# EAGLE design Macropad schem 1 (EAGLE 9.6.1)
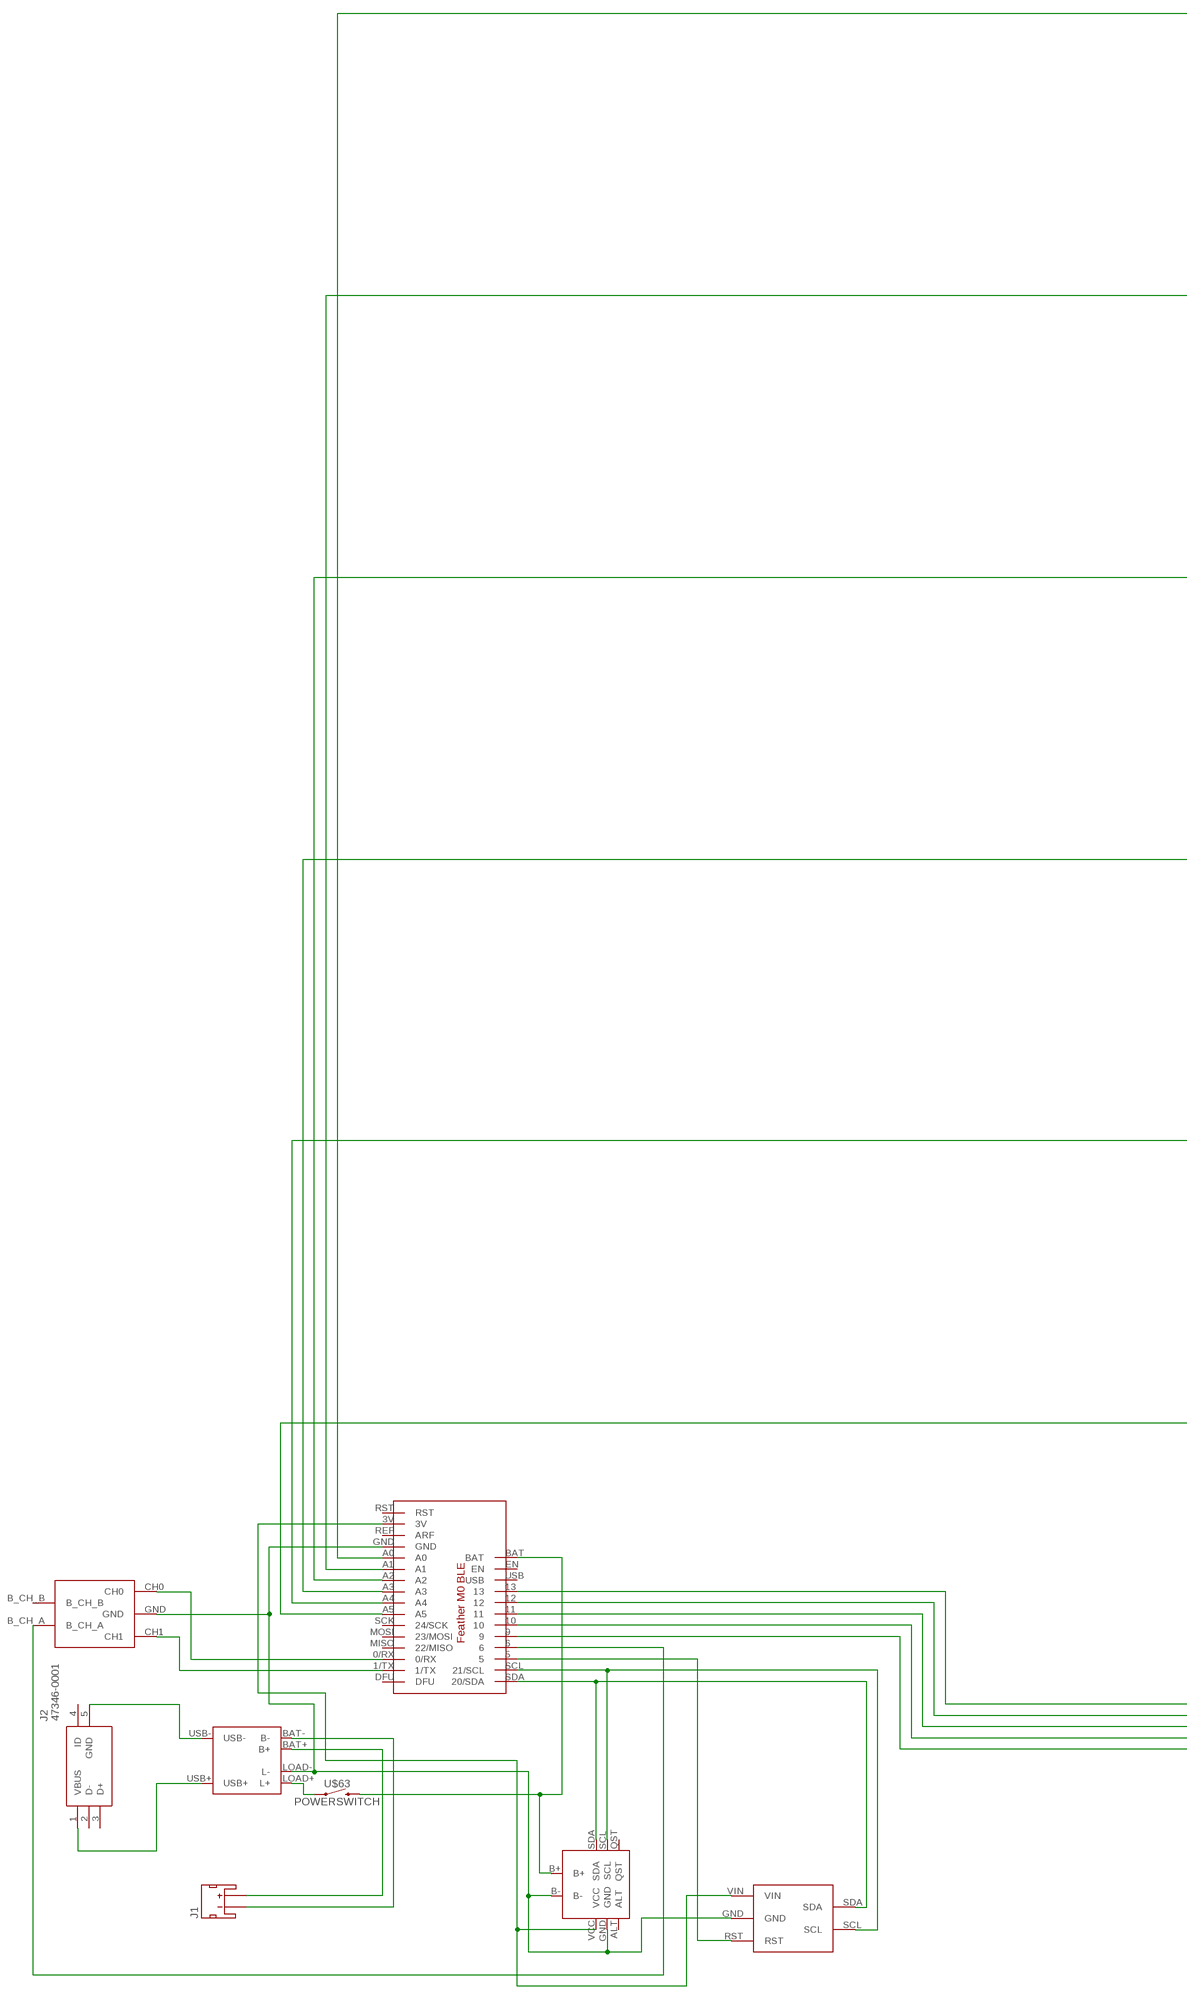
[diagram p0: schematic, sheet 1, part 1 of 2]
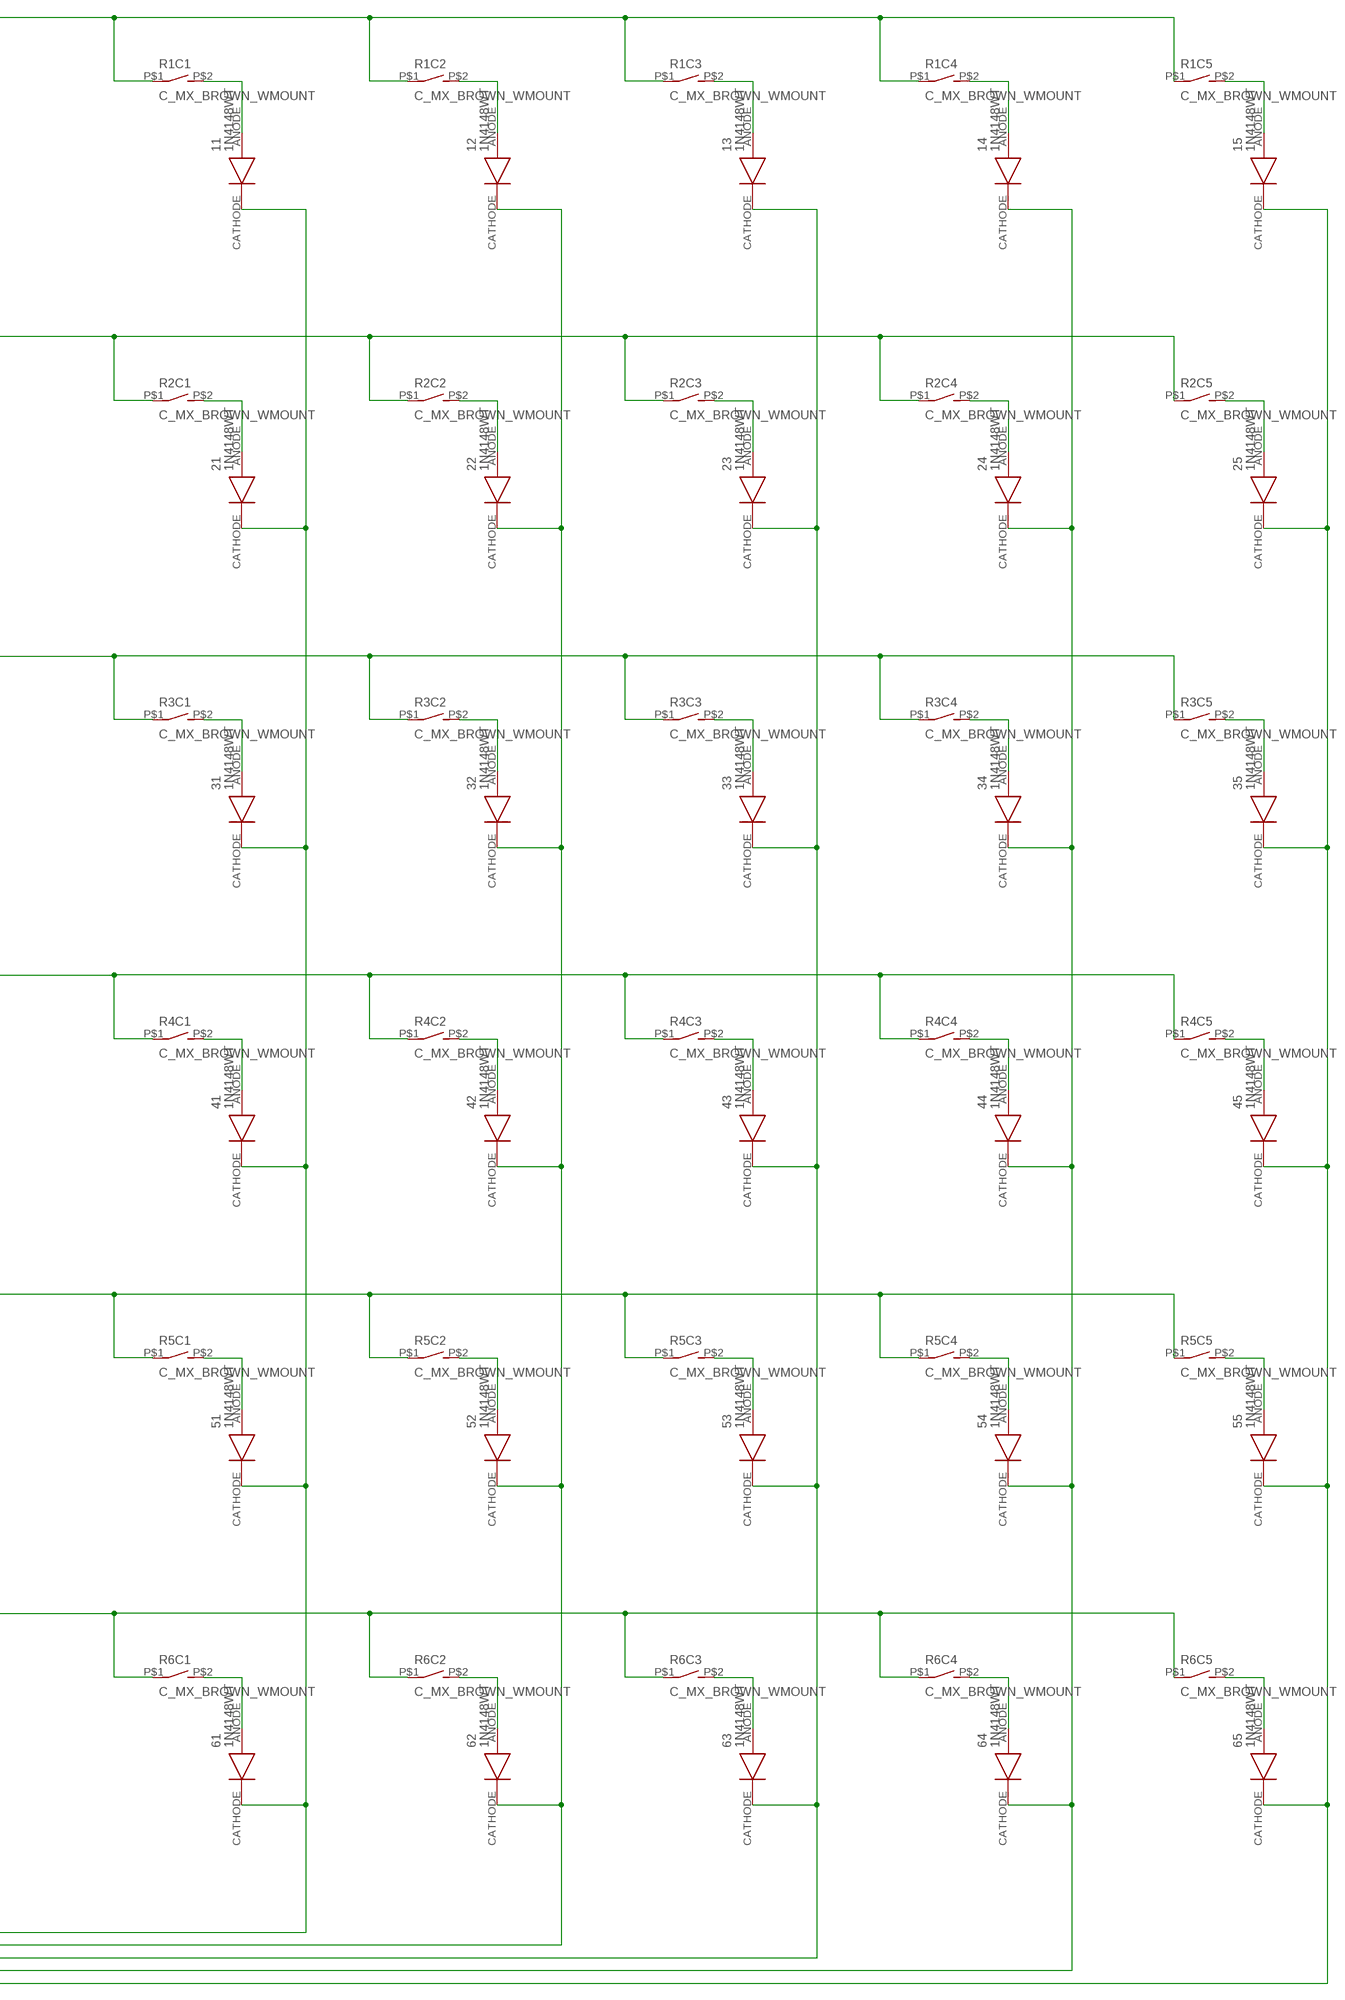
[diagram p1: schematic, sheet 1, part 2 of 2]

## Parts
11  1N4148WT  [1N4148WT]
12  1N4148WT  [1N4148WT]
13  1N4148WT  [1N4148WT]
14  1N4148WT  [1N4148WT]
15  1N4148WT  [1N4148WT]
21  1N4148WT  [1N4148WT]
22  1N4148WT  [1N4148WT]
23  1N4148WT  [1N4148WT]
24  1N4148WT  [1N4148WT]
25  1N4148WT  [1N4148WT]
31  1N4148WT  [1N4148WT]
32  1N4148WT  [1N4148WT]
33  1N4148WT  [1N4148WT]
34  1N4148WT  [1N4148WT]
35  1N4148WT  [1N4148WT]
41  1N4148WT  [1N4148WT]
42  1N4148WT  [1N4148WT]
43  1N4148WT  [1N4148WT]
44  1N4148WT  [1N4148WT]
45  1N4148WT  [1N4148WT]
51  1N4148WT  [1N4148WT]
52  1N4148WT  [1N4148WT]
53  1N4148WT  [1N4148WT]
54  1N4148WT  [1N4148WT]
55  1N4148WT  [1N4148WT]
61  1N4148WT  [1N4148WT]
62  1N4148WT  [1N4148WT]
63  1N4148WT  [1N4148WT]
64  1N4148WT  [1N4148WT]
65  1N4148WT  [1N4148WT]
J1  JST_2MM_MALE  [JST-2-SMD]
J2  47346-0001  [47346-0001]
R1C1  C_MX_BROWN_WMOUNT  [C_MX_BROWN_WMOUNT]
R1C2  C_MX_BROWN_WMOUNT  [C_MX_BROWN_WMOUNT]
R1C3  C_MX_BROWN_WMOUNT  [C_MX_BROWN_WMOUNT]
R1C4  C_MX_BROWN_WMOUNT  [C_MX_BROWN_WMOUNT]
R1C5  C_MX_BROWN_WMOUNT  [C_MX_BROWN_WMOUNT]
R2C1  C_MX_BROWN_WMOUNT  [C_MX_BROWN_WMOUNT]
R2C2  C_MX_BROWN_WMOUNT  [C_MX_BROWN_WMOUNT]
R2C3  C_MX_BROWN_WMOUNT  [C_MX_BROWN_WMOUNT]
R2C4  C_MX_BROWN_WMOUNT  [C_MX_BROWN_WMOUNT]
R2C5  C_MX_BROWN_WMOUNT  [C_MX_BROWN_WMOUNT]
R3C1  C_MX_BROWN_WMOUNT  [C_MX_BROWN_WMOUNT]
R3C2  C_MX_BROWN_WMOUNT  [C_MX_BROWN_WMOUNT]
R3C3  C_MX_BROWN_WMOUNT  [C_MX_BROWN_WMOUNT]
R3C4  C_MX_BROWN_WMOUNT  [C_MX_BROWN_WMOUNT]
R3C5  C_MX_BROWN_WMOUNT  [C_MX_BROWN_WMOUNT]
R4C1  C_MX_BROWN_WMOUNT  [C_MX_BROWN_WMOUNT]
R4C2  C_MX_BROWN_WMOUNT  [C_MX_BROWN_WMOUNT]
R4C3  C_MX_BROWN_WMOUNT  [C_MX_BROWN_WMOUNT]
R4C4  C_MX_BROWN_WMOUNT  [C_MX_BROWN_WMOUNT]
R4C5  C_MX_BROWN_WMOUNT  [C_MX_BROWN_WMOUNT]
R5C1  C_MX_BROWN_WMOUNT  [C_MX_BROWN_WMOUNT]
R5C2  C_MX_BROWN_WMOUNT  [C_MX_BROWN_WMOUNT]
R5C3  C_MX_BROWN_WMOUNT  [C_MX_BROWN_WMOUNT]
R5C4  C_MX_BROWN_WMOUNT  [C_MX_BROWN_WMOUNT]
R5C5  C_MX_BROWN_WMOUNT  [C_MX_BROWN_WMOUNT]
R6C1  C_MX_BROWN_WMOUNT  [C_MX_BROWN_WMOUNT]
R6C2  C_MX_BROWN_WMOUNT  [C_MX_BROWN_WMOUNT]
R6C3  C_MX_BROWN_WMOUNT  [C_MX_BROWN_WMOUNT]
R6C4  C_MX_BROWN_WMOUNT  [C_MX_BROWN_WMOUNT]
R6C5  C_MX_BROWN_WMOUNT  [C_MX_BROWN_WMOUNT]
U$61  ADA_FEATHER_M0_BLE  [ADA_FEATHER_M0_BLE]
U$62  ADA_LIIONCHARGER_V1.2  [ADA_LIIONCHARGER_V1.2]
U$63  POWERSWITCH  [POWERSWITCH]
U$64  LIPO_FUEL_GAUGE  [LIPO_FUEL_GAUGE]
U$65  COM-09117  [COM-09117]
U$66  I2C_OLED_DISP  [I2C_OLED_DISP]

## Nets
12: 12.CATHODE 22.CATHODE 32.CATHODE 42.CATHODE 52.CATHODE 62.CATHODE U$61.12
N$1: 11.ANODE R1C1.P$2
N$2: 12.ANODE R1C2.P$2
N$3: 13.ANODE R1C3.P$2
N$4: 14.ANODE R1C4.P$2
N$5: 15.ANODE R1C5.P$2
N$6: R1C1.P$1 R1C2.P$1 R1C3.P$1 R1C4.P$1 R1C5.P$1 U$61.A0
N$7: 21.ANODE R2C1.P$2
N$8: 22.ANODE R2C2.P$2
N$9: 23.ANODE R2C3.P$2
N$10: 24.ANODE R2C4.P$2
N$11: 25.ANODE R2C5.P$2
N$12: R2C1.P$1 R2C2.P$1 R2C3.P$1 R2C4.P$1 R2C5.P$1 U$61.A1
N$13: 31.ANODE R3C1.P$2
N$14: 32.ANODE R3C2.P$2
N$15: 33.ANODE R3C3.P$2
N$16: 34.ANODE R3C4.P$2
N$17: 35.ANODE R3C5.P$2
N$18: R3C1.P$1 R3C2.P$1 R3C3.P$1 R3C4.P$1 R3C5.P$1 U$61.A2
N$19: 41.ANODE R4C1.P$2
N$20: 42.ANODE R4C2.P$2
N$21: 43.ANODE R4C3.P$2
N$22: 44.ANODE R4C4.P$2
N$23: 45.ANODE R4C5.P$2
N$24: R4C1.P$1 R4C2.P$1 R4C3.P$1 R4C4.P$1 R4C5.P$1 U$61.A3
N$25: 51.ANODE R5C1.P$2
N$26: 52.ANODE R5C2.P$2
N$27: 53.ANODE R5C3.P$2
N$28: 54.ANODE R5C4.P$2
N$29: 55.ANODE R5C5.P$2
N$30: R5C1.P$1 R5C2.P$1 R5C3.P$1 R5C4.P$1 R5C5.P$1 U$61.A4
N$31: 61.ANODE R6C1.P$2
N$32: 62.ANODE R6C2.P$2
N$33: 63.ANODE R6C3.P$2
N$34: 64.ANODE R6C4.P$2
N$35: 65.ANODE R6C5.P$2
N$36: R6C1.P$1 R6C2.P$1 R6C3.P$1 R6C4.P$1 R6C5.P$1 U$61.A5
N$37: 11.CATHODE 21.CATHODE 31.CATHODE 41.CATHODE 51.CATHODE 61.CATHODE U$61.13
N$39: 13.CATHODE 23.CATHODE 33.CATHODE 43.CATHODE 53.CATHODE 63.CATHODE U$61.11
N$40: 14.CATHODE 24.CATHODE 34.CATHODE 44.CATHODE 54.CATHODE 64.CATHODE U$61.10
N$41: 15.CATHODE 25.CATHODE 35.CATHODE 45.CATHODE 55.CATHODE 65.CATHODE U$61.9
N$42: U$62.LOAD+(L+) U$63.1
N$43: U$61.BAT U$63.2 U$64.B+
N$44: U$61.GND U$62.LOAD-(L-) U$64.B- U$64.GND U$65.GND U$66.GND
N$45: U$61.SDA(20/SDA) U$64.SDA U$66.SDA
N$46: U$61.SCL(21/SCL) U$64.SCL U$66.SCL
N$47: J1.2(+) U$62.BAT+(B+)
N$48: U$61.3V U$64.VCC U$66.VIN
N$49: J1.1(-) U$62.BAT-(B-)
N$50: J2.5(GND) U$62.USB-
N$51: J2.1(VBUS) U$62.USB+
N$52: U$61.1/TX U$65.CH1
N$53: U$61.0/RX U$65.CH0
N$54: U$61.6 U$65.B_CH_A
N$57: U$61.5 U$66.RST
Unconnected: J1.NC1(PAD1) J1.NC2(PAD2) J2.2(D-) J2.3(D+) J2.4(ID) U$61.DFU U$61.EN U$61.MISO(22/MISO) U$61.MOSI(23/MOSI) U$61.REF(ARF) U$61.RST U$61.SCK(24/SCK) U$61.USB U$64.ALT U$64.QST U$65.B_CH_B

## Library data of the parts
11-15 21-25 31-35 41-45 51-55 61-65 = Macro-Pad:1N4148WT
J1 = SparkFun-Connectors:JST_2MM_MALE: JST 2MM MALE RA CONNECTOR Two pin, compact surface mount connector. Commonly used as a battery input connection point. We really like the solid locking feeling and high current rating on these small connectors. We use these all the time as battery connectors. Mates to single-cell LiPo batteries. Here is the connector we sell at SparkFun: JST Right Angle Connector - White <https://www.sparkfun.com/products/8612> (PRT-08612) Datasheet <http://www.sparkfun.com/datasheets/Prototyping/Connectors/JST-Horizontal.pdf> It was used on these SparkFun products: SparkFun MOSFET Power Controller <https://www.sparkfun.com/products/11214> (PRT-11214) SparkFun Battery Babysitter - LiPo Battery Manager <https://www.sparkfun.com/products/13777> (PRT-13777) And many, many others that required a lipo battery connection.; PROD_ID: CONN-11443; SF_ID: PRT-08612
J2 = SamacSys_Parts:47346-0001: Micro USB B Receptacle Bottom Mount Assy Molex Right Angle SMT Type B Version 2.0 Micro USB Connector Socket, 30 V ac, 1A 47352 MICRO-USB Source: Datasheet <http://www.molex.com/pdm_docs/sd/473460001_sd.pdf>; DESCRIPTION: Micro USB B Receptacle Bottom Mount Assy Molex Right Angle SMT Type B Version 2.0 Micro USB Connector Socket, 30 V ac, 1A 47352 MICRO-USB; HEIGHT: mm; MANUFACTURER_NAME: Molex; MANUFACTURER_PART_NUMBER: 47346-0001; MOUSER_PART_NUMBER: 538-47346-0001; MOUSER_PRICE-STOCK: https://www.mouser.co.uk/ProductDetail/Molex/47346-0001?qs=c2CV6XM0DweJBWaSeyWeCw%3D%3D
R1C1-R1C5 R2C1-R2C5 R3C1-R3C5 R4C1-R4C5 R5C1-R5C5 R6C1-R6C5 = Macro-Pad:C_MX_BROWN_WMOUNT
U$61 = Macro-Pad:ADA_FEATHER_M0_BLE
U$62 = Macro-Pad:ADA_LIIONCHARGER_V1.2
U$63 = Macro-Pad:POWERSWITCH
U$64 = Macro-Pad:LIPO_FUEL_GAUGE
U$65 = Macro-Pad:COM-09117
U$66 = Macro-Pad:I2C_OLED_DISP

## Board
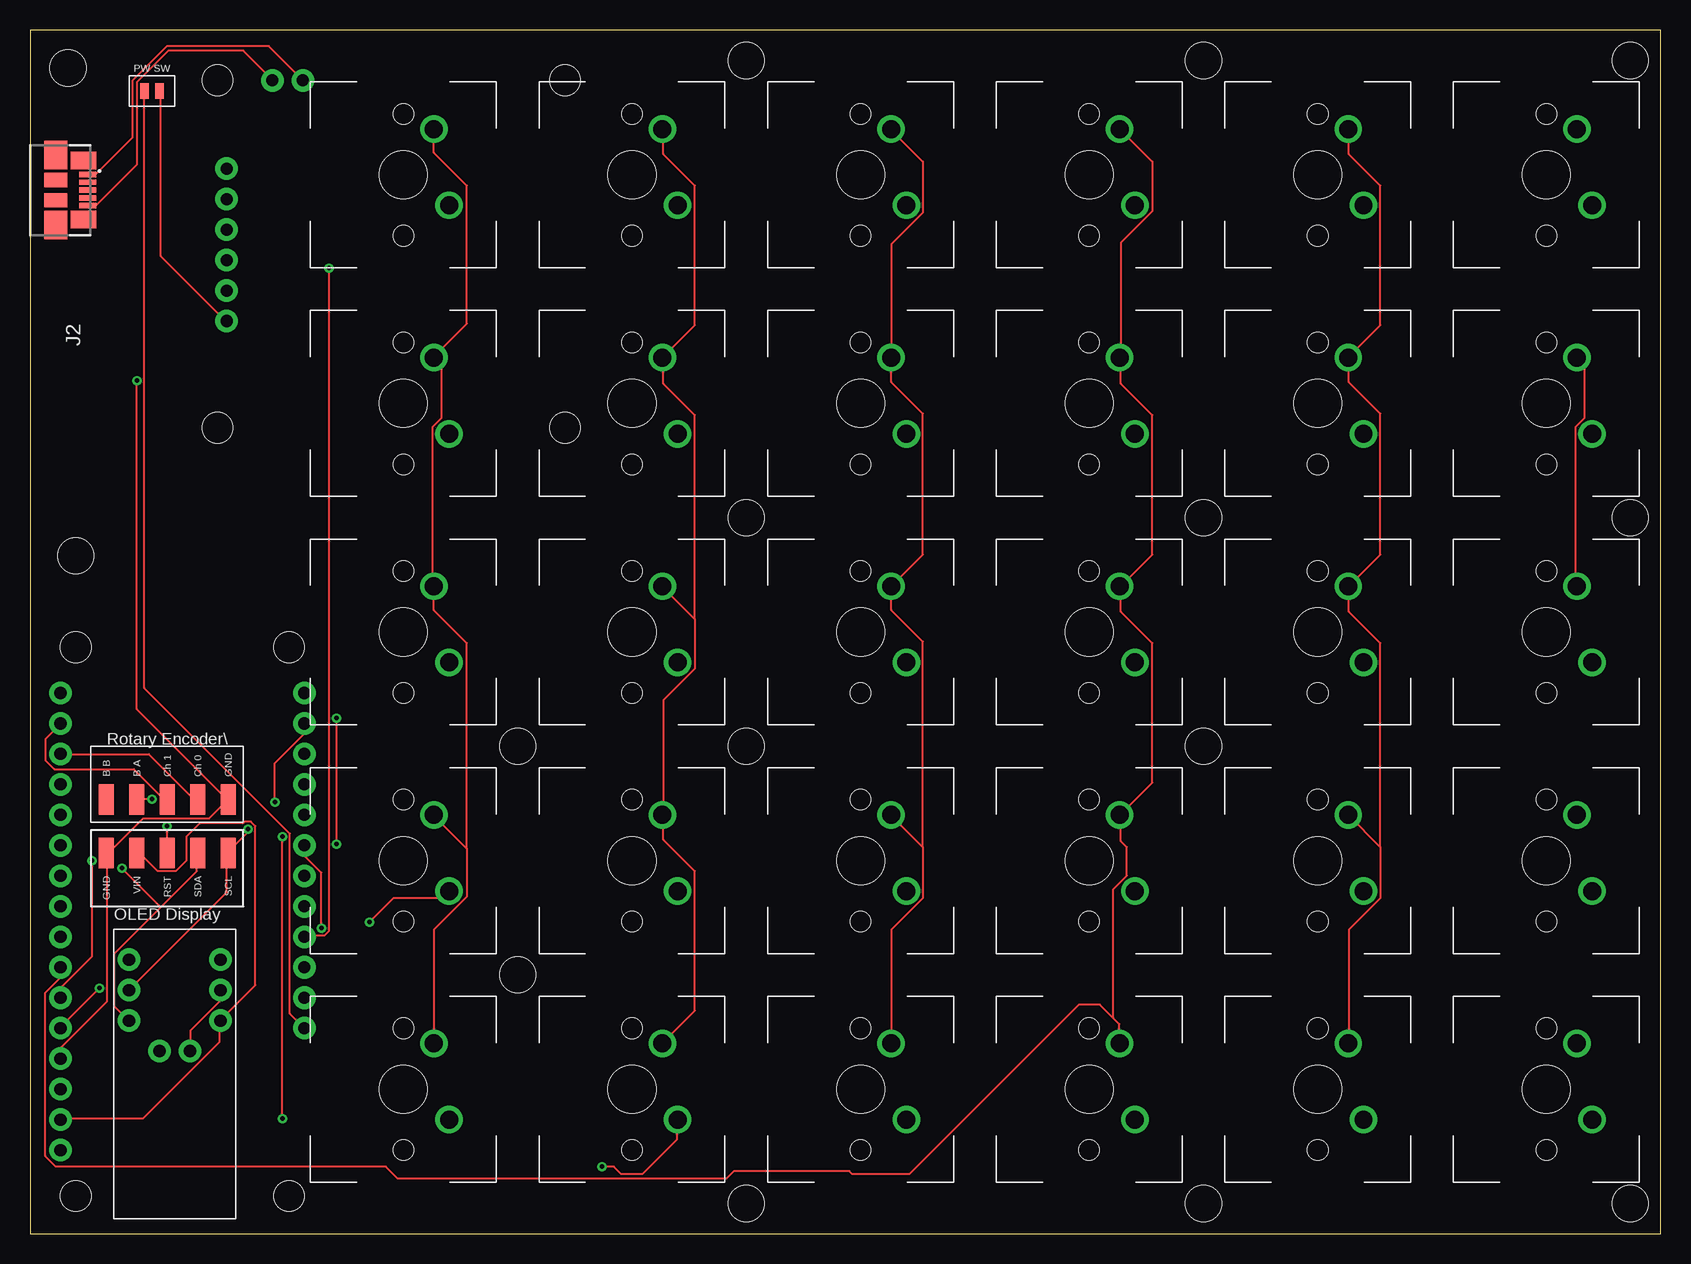
[diagram p2: board, top side]
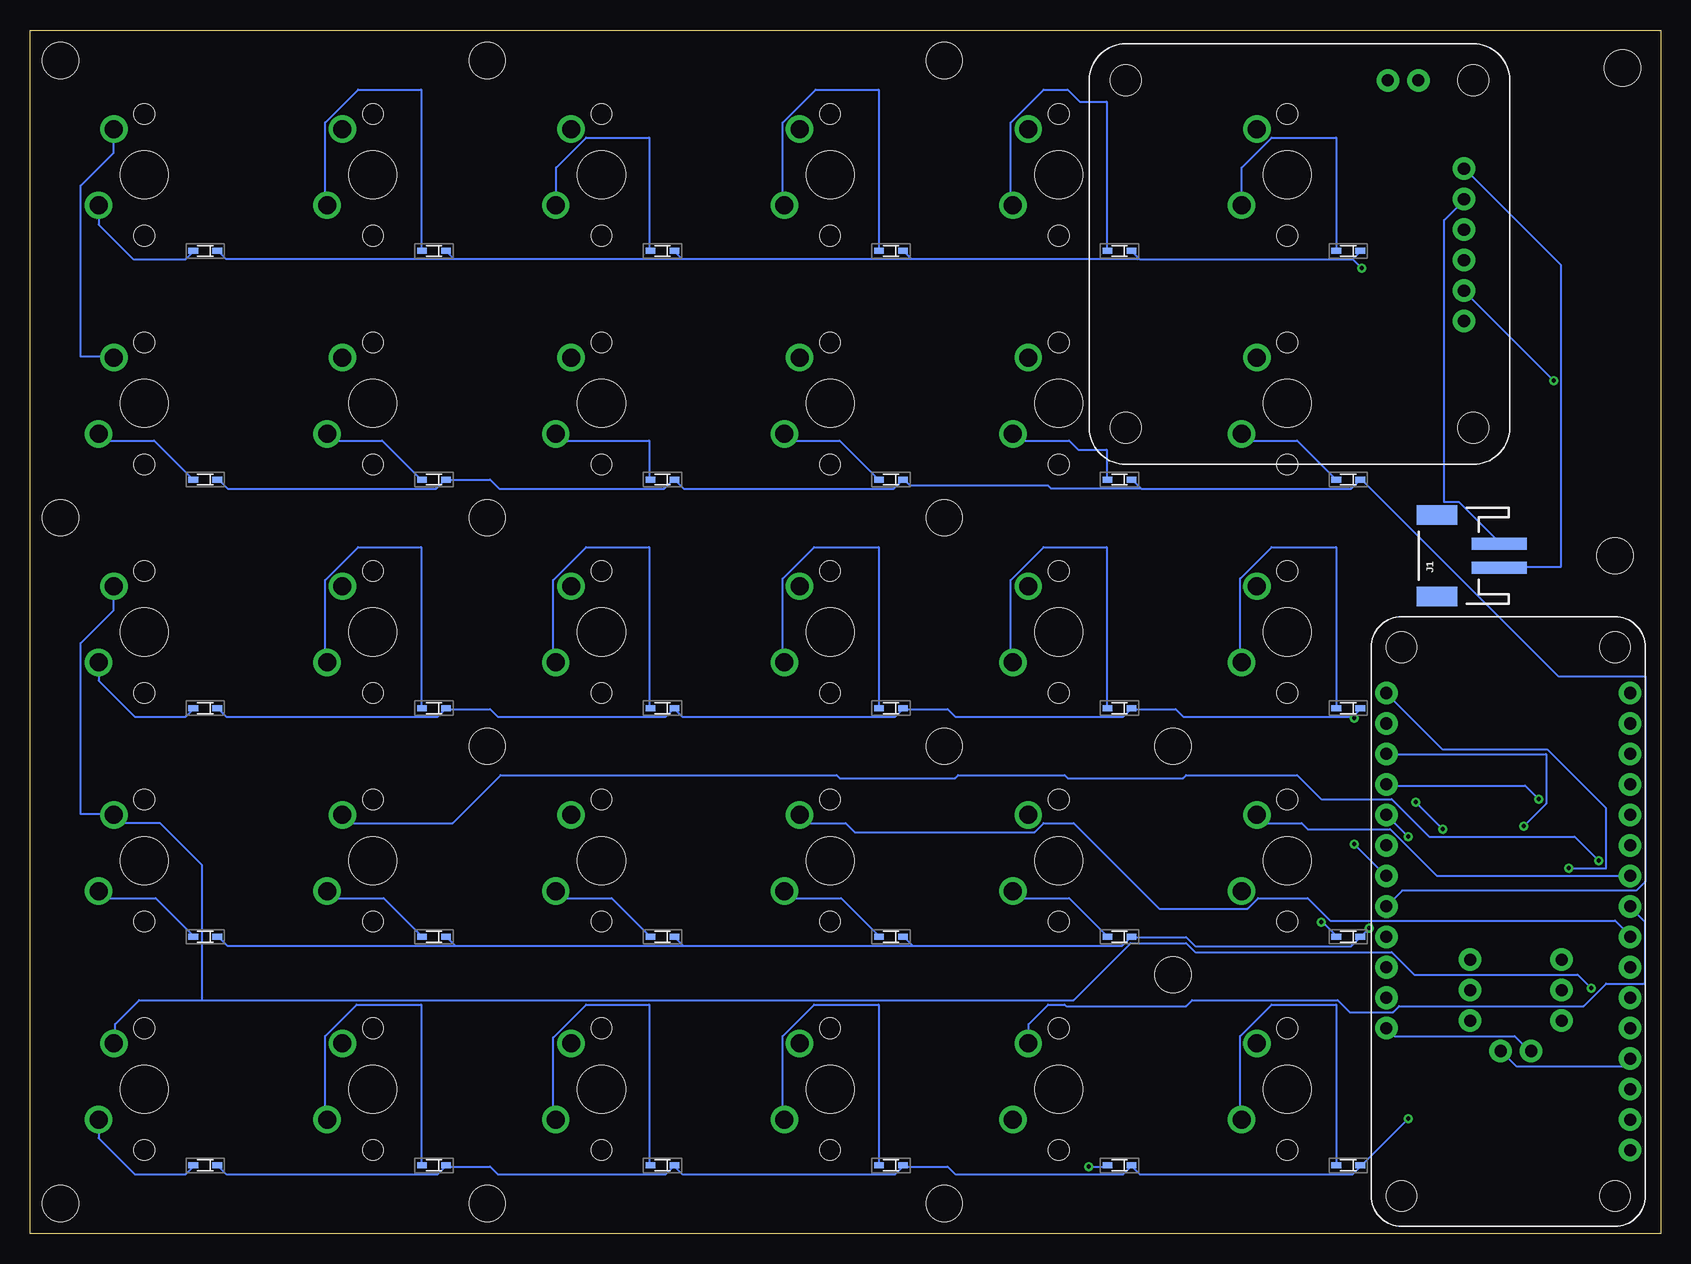
[diagram p3: board, bottom side, seen from below]

Size 135.89 x 100.33 mm. Coordinates in mm from the lower left corner, seen from the top.
Outline: 0,0 135.89,0 135.89,100.33 0,100.33 0,0
Copper layers (1*16): Top 0.035mm / dielectric 1.5mm / Bottom 0.035mm
Design rules "default": minimum track width 6mil, minimum drill 0.35mm, track to track 6mil, track to pad 6mil, pad to pad 6mil, via to via 6mil, smd to smd 6mil, copper to edge 40mil, drill to drill 6mil, minimum pad ring 10mil, minimum via ring 8mil, stop-mask expansion 4mil, vias tented up to drill 0mil, thermal gap 10mil
Holes 3 mm at 133.35,97.79 133.35,2.54 3.81,56.52 3.17,97.16 133.35,59.69 97.79,2.54 97.79,97.79 97.79,59.69 97.79,40.64 59.69,2.54 59.69,97.79 59.69,59.69 59.69,40.64 40.64,21.59 40.64,40.64

### Footprints (pad centres in the part's own frame; a part is rotated, then mirrored left to right if it is on the bottom)
1N4148WT = smd 0.8 x 0.5: ANODE 1,0; CATHODE -1,0
JST-2-SMD = smd 1 x 4.6: 1 -1,-3.7; 2 1,-3.7 | smd 1.6 x 3.4: NC1 -3.4,1.5; NC2 3.4,1.5
47346-0001 = smd 0.45 x 1.38: 1 1.3,-4.81; 2 0.65,-4.81; 3 0,-4.81; 4 -0.65,-4.81; 5 -1.3,-4.81 | smd 1.475 x 2.1: 6 -2.453,-4.45; 7 2.453,-4.45 | smd 1.175 x 1.9: 8 0.838,-2.15; 9 -0.838,-2.15 | smd 2.375 x 1.9: 10 2.913,-2.15; 11 -2.913,-2.15
C_MX_BROWN_WMOUNT = drill 1.499 pad 2.286: P$1 -3.81,2.54; P$2 2.54,3.81 | hole 3.988: 0,0 | hole 1.702: -5.08,0; 5.08,0
ADA_FEATHER_M0_BLE = drill 1.016 pad 1.88: 0/RX 13.97,-10.16; 1/TX 16.51,-10.16; 3V -16.51,-10.16; 5 13.97,10.16; 6 11.43,10.16; 9 8.89,10.16; 10 6.35,10.16; 11 3.81,10.16; 12 1.27,10.16; 13 -1.27,10.16; A0 -8.89,-10.16; A1 -6.35,-10.16; A2 -3.81,-10.16; A3 -1.27,-10.16; A4 1.27,-10.16; A5 3.81,-10.16; BAT -8.89,10.16; DFU 19.05,-10.16; EN -6.35,10.16; GND -11.43,-10.16; MISO 11.43,-10.16; MOSI 8.89,-10.16; REF -13.97,-10.16; RST -19.05,-10.16; SCK 6.35,-10.16; SCL 16.51,10.16; SDA 19.05,10.16; USB -3.81,10.16 | hole 2.54: 22.86,-8.89; 22.86,8.89; -22.86,-8.89; -22.86,8.89
ADA_LIIONCHARGER_V1.2 = drill 1.016 pad 1.88: BAT+ 31.242,22.098; BAT- 31.242,24.638; LOAD+ 31.242,11.938; LOAD- 31.242,14.478; STAT1 31.242,19.558; STAT2 31.242,17.018; USB+ 24.892,32.004; USB- 27.432,32.004 | hole 2.54: 3.048,3.048; 3.048,32.004; 32.004,32.004; 32.004,3.048
POWERSWITCH = smd 0.711 x 1.295: 1 -1.27,0; 2 0,0
LIPO_FUEL_GAUGE = drill 1.016 pad 1.88: ALT 0,0; B+ -7.62,5.08; B- -7.62,2.54; GND -2.54,0; QST 0,7.62; SCL -2.54,7.62; SDA -5.08,7.62; VCC -5.08,0
COM-09117 = smd 1.27 x 2.54: B_CH_A 6.35,0; B_CH_B 8.89,0; CH0 1.27,0; CH1 3.81,0; GND -1.27,0
I2C_OLED_DISP = smd 1.27 x 2.54: GND -5.08,0; RST 0,0; SCL 5.08,0; SDA 2.54,0; VIN -2.54,0

### Placement (x,y rotation side)
11  121.28,81.91 180 bottom
12  121.28,62.87 180 bottom
13  121.28,43.82 180 bottom
14  121.28,24.76 180 bottom
15  121.28,5.71 180 bottom
21  102.23,81.91 180 bottom
22  102.23,62.87 180 bottom
23  102.23,43.82 180 bottom
24  102.23,24.76 180 bottom
25  102.23,5.71 180 bottom
31  83.19,81.91 180 bottom
32  83.19,62.87 180 bottom
33  83.19,43.82 180 bottom
34  83.19,24.76 180 bottom
35  83.19,5.71 180 bottom
41  64.13,81.91 180 bottom
42  64.13,62.87 180 bottom
43  64.13,43.82 180 bottom
44  64.13,24.76 180 bottom
45  64.13,5.71 180 bottom
51  45.09,81.91 180 bottom
52  45.09,62.87 180 bottom
53  45.09,43.82 180 bottom
54  45.09,24.76 180 bottom
55  45.09,5.71 180 bottom
61  26.04,81.91 180 bottom
62  26.04,62.87 180 bottom
63  26.04,43.82 180 bottom
64  26.04,24.76 180 bottom
65  26.04,5.71 180 bottom
J1  17.14,56.52 90 bottom
J2  0,86.99 90 top
R1C1  126.37,88.27 270 top
R1C2  126.37,69.21 270 top
R1C3  126.37,50.16 270 top
R1C4  126.37,31.11 270 top
R1C5  126.37,12.06 270 top
R2C1  107.31,88.27 270 top
R2C2  107.31,69.21 270 top
R2C3  107.31,50.16 270 top
R2C4  107.31,31.11 270 top
R2C5  107.31,12.06 270 top
R3C1  88.26,88.27 270 top
R3C2  88.26,69.21 270 top
R3C3  88.26,50.16 270 top
R3C4  88.26,31.11 270 top
R3C5  88.26,12.06 270 top
R4C1  69.22,88.27 270 top
R4C2  69.22,69.21 270 top
R4C3  69.22,50.16 270 top
R4C4  69.22,31.11 270 top
R4C5  69.22,12.06 270 top
R5C1  50.16,88.27 270 top
R5C2  50.16,69.21 270 top
R5C3  50.16,50.16 270 top
R5C4  50.16,31.11 270 top
R5C5  50.16,12.06 270 top
R6C1  31.11,88.27 270 top
R6C2  31.11,69.21 270 top
R6C3  31.11,50.16 270 top
R6C4  31.11,31.11 270 top
R6C5  31.11,12.06 270 top
U$61  12.7,26.04 90 bottom
U$62  47.62,64.13 0 bottom
U$63  9.52,95.25 180 top
U$64  15.88,22.86 90 top
U$65  15.24,36.2 180 top
U$66  11.43,31.75 0 top

### Tracks (layer width: path | path; a pad name or v marks a point on that pad's centre or on a via)
12
  Bottom 0.152: 12.CATHODE 120.16,62.87 119.41,62.12 102.04,62.12 101.29,62.87 22.CATHODE 97.54,62.87 96.79,62.12 83.04,62.12 82.29,62.87 32.CATHODE 82.16,62.87 81.41,62.12 63.91,62.12 63.16,62.87 42.CATHODE 63.04,62.87 62.54,62.37 51.04,62.37 50.79,62.12 43.29,62.12 | 43.29,62.12 25.79,62.12 62.CATHODE 24.91,62.87 8.54,46.49 1.29,46.49 1.29,29.36 2.04,28.61 21.54,28.61 22.79,27.36 U$61.12 | 43.29,62.12 44.04,62.87 52.CATHODE
N$1
  Bottom 0.152: 11.ANODE 122.29,81.86 122.91,81.24 127.29,81.24 130.16,84.11 130.16,85.61 R1C1.P$2
N$2
  Bottom 0.152: 12.ANODE 125.54,66.11 129.66,66.11 130.16,66.61 R1C2.P$2
N$3
  Bottom 0.152: 13.ANODE 122.29,43.74 122.91,43.12 127.16,43.12 130.16,46.12 R1C3.P$2
N$4
  Bottom 0.152: 14.ANODE 122.29,24.86 125.41,27.99 129.66,27.99 130.16,28.49 R1C4.P$2
N$5
  Bottom 0.152: 15.ANODE 122.29,5.62 122.91,4.99 127.16,4.99 130.16,7.99 130.16,9.49 R1C5.P$2
N$6  (via drill 0.35)
  Top 0.152: R1C3.P$1 128.79,53.99 128.79,67.24 129.54,67.99 129.54,72.36 128.91,72.99 R1C2.P$1 | v5.79,20.49 2.54,17.24 U$61.A0
  Bottom 0.152: R1C1.P$1 128.91,91.99 128.91,90.11 131.66,87.36 131.66,73.11 128.91,73.11 R1C2.P$1 | v5.79,20.49 6.91,21.61 20.54,21.61 22.41,23.49 38.79,23.49 39.54,24.24 44.16,24.24 48.91,19.49 121.54,19.49 | 121.54,19.49 126.79,19.49 128.79,17.49 128.79,15.99 R1C5.P$1 | 121.54,19.49 121.54,30.74 125.04,34.24 128.16,34.24 128.79,34.87 R1C4.P$1 128.91,34.99 131.66,34.99 131.66,49.24 128.91,51.99 128.91,53.87 R1C3.P$1
N$7
  Bottom 0.152: 21.ANODE 103.29,81.99 103.29,95.36 108.54,95.36 111.29,92.61 111.29,85.74 111.16,85.74 R2C1.P$2
N$8
  Bottom 0.152: 22.ANODE 103.29,62.87 106.54,66.11 110.54,66.11 111.04,66.61 R2C2.P$2
N$9
  Bottom 0.152: 23.ANODE 103.29,43.87 103.29,57.24 108.54,57.24 111.29,54.49 111.29,47.74 111.16,47.74 R2C3.P$2
N$10
  Bottom 0.152: R2C4.P$2 110.54,27.99 106.41,27.99 103.29,24.86 24.ANODE
N$11
  Bottom 0.152: 25.ANODE 103.29,5.74 103.29,19.11 108.66,19.11 111.29,16.49 111.29,9.62 111.16,9.62 R2C5.P$2
N$12  (via drill 0.35)
  Top 0.152: U$61.A1 2.54,20.49 5.16,23.11 v5.16,31.11 | 112.54,32.24 112.54,27.99 109.91,25.36 109.91,15.99 R2C5.P$1 | R2C4.P$1 112.54,32.24 | 112.54,32.24 112.54,49.24 109.91,51.87 109.91,53.87 R2C3.P$1 109.91,53.99 112.54,56.62 112.54,68.36 109.91,70.99 109.91,72.99 R2C2.P$1 109.91,73.11 112.54,75.74 112.54,87.36 109.91,89.99 109.91,91.99 R2C1.P$1
  Bottom 0.152: v5.16,31.11 7.16,33.12 19.29,33.12 22.41,36.24 28.29,36.24 30.29,38.24 39.54,38.24 39.79,37.99 49.41,37.99 49.66,38.24 58.54,38.24 58.79,37.99 68.41,37.99 68.66,38.24 96.66,38.24 100.66,34.24 109.16,34.24 109.79,34.87 R2C4.P$1
N$13
  Bottom 0.152: 31.ANODE 84.29,81.99 84.29,91.36 89.54,91.36 92.04,88.86 92.04,85.74 R3C1.P$2
N$14
  Bottom 0.152: 32.ANODE 84.29,62.87 84.29,66.11 91.54,66.11 92.04,66.61 R3C2.P$2
N$15
  Bottom 0.152: 33.ANODE 84.29,43.87 84.29,57.24 89.54,57.24 92.29,54.49 92.29,47.74 92.16,47.74 R3C3.P$2
N$16
  Bottom 0.152: 34.ANODE 84.29,24.86 87.41,27.99 91.54,27.99 92.04,28.49 R3C4.P$2
N$17
  Bottom 0.152: 35.ANODE 84.29,5.74 84.29,19.11 89.54,19.11 92.29,16.36 92.29,9.62 92.16,9.62 R3C5.P$2
N$18
  Top 0.152: R3C1.P$1 90.91,91.99 93.54,89.36 93.54,85.24 90.91,82.61 90.91,73.11 R3C2.P$1 90.91,72.99 90.91,70.86 93.54,68.24 93.54,56.62 90.91,53.99 R3C3.P$1 90.91,53.87 90.91,51.87 93.54,49.24 93.54,37.62 90.91,34.99 R3C4.P$1 90.91,34.87 90.91,32.74 91.41,32.24 91.41,29.86 90.29,28.74 90.29,17.99 | U$61.A2 2.54,21.36 1.29,20.11 1.29,6.49 2.16,5.62 29.66,5.62 30.66,4.62 58.04,4.62 58.66,5.24 68.29,5.24 68.54,4.99 73.29,4.99 87.41,19.11 89.16,19.11 90.29,17.99 | 90.29,17.99 90.79,17.49 90.79,15.99 R3C5.P$1
N$19
  Bottom 0.152: 41.ANODE 65.16,81.99 65.16,95.36 70.41,95.36 73.16,92.61 73.16,85.74 73.04,85.74 R4C1.P$2
N$20
  Bottom 0.152: 42.ANODE 65.16,62.87 68.41,66.11 72.41,66.11 72.91,66.61 R4C2.P$2
N$21
  Bottom 0.152: 43.ANODE 65.16,43.87 65.16,57.24 70.54,57.24 73.16,54.62 73.16,47.74 73.04,47.74 R4C3.P$2
N$22
  Bottom 0.152: 44.ANODE 65.16,24.86 68.29,27.99 72.41,27.99 72.91,28.49 R4C4.P$2
N$23
  Bottom 0.152: 45.ANODE 65.16,5.74 65.16,19.11 70.54,19.11 73.16,16.49 73.16,9.62 73.04,9.62 R4C5.P$2
N$24
  Top 0.152: R4C1.P$1 71.79,91.99 74.41,89.36 74.41,85.11 71.79,82.49 71.79,73.11 R4C2.P$1 71.79,72.99 71.79,70.99 74.41,68.36 74.41,56.62 71.79,53.99 R4C3.P$1 71.79,53.87 71.79,51.99 74.41,49.37 74.41,32.24 | 74.41,32.24 74.41,27.99 71.79,25.36 71.79,15.99 R4C5.P$1 | 74.41,32.24 71.79,34.87 R4C4.P$1
  Bottom 0.152: U$61.A3 2.54,24.86 3.79,26.11 27.54,26.11 29.41,27.99 33.54,27.99 34.41,27.11 41.79,27.11 48.91,34.24 51.41,34.24 52.16,33.49 67.16,33.49 67.91,34.24 71.04,34.24 71.66,34.87 R4C4.P$1
N$25
  Bottom 0.152: 51.ANODE 46.16,81.99 46.16,94.36 48.41,94.36 49.41,95.36 51.41,95.36 54.16,92.61 54.16,85.74 54.04,85.74 R5C1.P$2
N$26
  Bottom 0.152: R5C2.P$2 53.41,66.11 49.29,66.11 48.54,65.36 46.16,65.36 46.16,62.87 52.ANODE
N$27
  Bottom 0.152: 53.ANODE 46.16,43.87 46.16,57.24 51.41,57.24 54.16,54.49 54.16,47.74 54.04,47.74 R5C3.P$2
N$28
  Bottom 0.152: 54.ANODE 46.16,24.86 49.29,27.99 53.41,27.99 53.91,28.49 R5C4.P$2
N$29  (via drill 0.35)
  Top 0.152: v47.66,5.62 48.66,5.62 49.29,4.99 51.04,4.99 53.91,7.87 53.91,9.49 R5C5.P$2
  Bottom 0.152: v47.66,5.62 46.16,5.62 55.ANODE
N$30
  Top 0.152: 55.41,51.24 55.41,47.12 52.79,44.49 52.79,34.99 R5C4.P$1 52.79,34.87 52.79,32.87 55.41,30.24 55.41,18.61 52.79,15.99 R5C5.P$1 | 55.41,51.24 52.79,53.87 R5C3.P$1 | 55.41,51.24 55.41,68.24 52.79,70.86 52.79,72.99 R5C2.P$1 52.79,73.11 55.41,75.74 55.41,87.36 52.79,89.99 52.79,91.99 R5C1.P$1
  Bottom 0.152: U$61.A4 2.54,27.24 1.29,25.99 1.29,20.86 4.54,20.86 6.41,18.99 21.79,18.99 22.29,18.49 25.91,18.49 26.91,19.49 39.04,19.49 39.54,18.99 49.54,18.99 49.66,19.11 51.04,19.11 52.66,17.49 52.66,15.99 R5C5.P$1
N$31
  Bottom 0.152: 61.ANODE 27.04,81.99 27.04,91.36 32.41,91.36 34.91,88.86 34.91,85.74 R6C1.P$2
N$32
  Bottom 0.152: 62.ANODE 30.29,66.11 34.41,66.11 34.91,66.61 R6C2.P$2
N$33
  Bottom 0.152: 63.ANODE 27.04,43.87 27.04,57.24 32.41,57.24 35.04,54.62 35.04,47.74 R6C3.P$2
N$34  (via drill 0.35)
  Top 0.152: v28.29,25.99 30.29,27.99 34.41,27.99 34.91,28.49 R6C4.P$2
  Bottom 0.152: v28.29,25.99 28.16,25.99 27.04,24.86 64.ANODE
N$35
  Bottom 0.152: 65.ANODE 27.04,5.74 27.04,19.11 32.41,19.11 35.04,16.49 35.04,9.62 R6C5.P$2
N$36
  Top 0.152: R6C1.P$1 33.66,91.99 33.66,90.11 36.41,87.36 36.41,75.86 33.66,73.11 R6C2.P$1 33.66,72.99 34.29,72.36 34.29,67.99 33.54,67.24 33.54,53.99 R6C3.P$1 33.66,53.87 33.66,51.99 36.41,49.24 36.41,32.12 | 36.41,32.12 36.41,28.11 33.66,25.36 33.66,15.99 R6C5.P$1 | 36.41,32.12 33.66,34.87 R6C4.P$1
  Bottom 0.152: U$61.A5 2.54,29.86 18.66,29.86 22.54,33.74 29.41,33.74 29.91,34.24 32.91,34.24 33.54,34.87 R6C4.P$1
N$37  (via drill 0.35)
  Top 0.152: v24.91,80.49 24.91,25.24 24.54,24.86 22.91,24.86 U$61.13
  Bottom 0.152: 25.66,81.24 25.04,81.86 61.CATHODE | 43.41,81.24 25.66,81.24 | 43.41,81.24 44.04,81.86 51.CATHODE | 62.41,81.24 63.04,81.86 41.CATHODE | 43.41,81.24 62.41,81.24 | 81.54,81.24 82.16,81.86 31.CATHODE | 62.41,81.24 81.54,81.24 | 100.54,81.24 101.16,81.86 21.CATHODE | 81.54,81.24 100.54,81.24 | 100.54,81.24 119.54,81.24 120.16,81.86 11.CATHODE | 25.66,81.24 v24.91,80.49
N$39  (via drill 0.35)
  Top 0.152: v25.54,42.99 v25.54,32.49
  Bottom 0.152: 25.66,43.12 25.04,43.74 63.CATHODE | 25.66,43.12 39.79,43.12 40.41,43.74 44.04,43.74 53.CATHODE 44.16,43.74 44.79,43.12 58.79,43.12 59.41,43.74 63.04,43.74 43.CATHODE 63.16,43.74 63.79,43.12 81.54,43.12 82.16,43.74 33.CATHODE 82.29,43.74 82.91,43.12 96.91,43.12 97.54,43.74 101.16,43.74 23.CATHODE 101.29,43.74 101.91,43.12 119.54,43.12 120.16,43.74 13.CATHODE | v25.54,32.49 22.91,29.86 U$61.11 | 25.66,43.12 v25.54,42.99
N$40  (via drill 0.35)
  Top 0.152: v24.29,25.49 24.29,30.11 22.91,31.49 22.91,32.37 U$61.10
  Bottom 0.152: 62.29,23.99 63.04,24.74 44.CATHODE | 62.29,23.99 44.91,23.99 44.16,24.74 54.CATHODE 44.04,24.74 39.54,24.74 38.79,23.99 25.79,23.99 25.04,24.74 64.CATHODE 24.91,24.86 v24.29,25.49 | 81.41,23.99 82.16,24.74 34.CATHODE | 62.29,23.99 81.41,23.99 | 100.41,23.99 101.16,24.74 24.CATHODE | 81.41,23.99 100.41,23.99 | 100.41,23.99 119.41,23.99 120.16,24.74 14.CATHODE
N$41  (via drill 0.35)
  Top 0.152: v21.04,9.62 v21.04,33.12
  Bottom 0.152: v21.04,33.12 22.79,34.87 U$61.9 | v21.04,9.62 24.91,5.74 65.CATHODE 25.04,5.62 25.66,4.99 43.41,4.99 44.04,5.62 55.CATHODE 44.16,5.62 44.79,4.99 58.79,4.99 59.41,5.62 63.04,5.62 45.CATHODE 63.16,5.62 63.79,4.99 81.54,4.99 82.16,5.62 35.CATHODE 82.29,5.62 82.91,4.99 96.91,4.99 97.54,5.62 101.16,5.62 25.CATHODE 101.29,5.62 101.91,4.99 119.54,4.99 120.16,5.62 15.CATHODE
N$42
  Top 0.152: U$63.1 10.91,95.24 10.91,81.49 16.29,76.11 U$62.LOAD+
N$43
  Top 0.152: U$63.2 9.54,95.24 9.54,45.49 21.66,33.37 21.66,18.36 22.79,17.24 U$61.BAT
  Bottom 0.152: U$64.B+ 10.91,15.24 12.16,16.49 22.16,16.49 22.79,17.11 U$61.BAT
N$44  (via drill 0.35)
  Top 0.152: U$64.GND 15.79,20.24 15.79,19.36 13.41,16.99 13.41,15.24 U$64.B- | v8.91,71.11 8.91,43.74 16.41,36.24 U$65.GND 16.41,36.12 14.91,34.62 9.41,34.62 6.66,31.86 6.41,31.86 U$66.GND 6.41,31.74 6.41,19.36 2.54,15.49 U$61.GND
  Bottom 0.152: U$61.GND 2.54,14.49 3.04,13.99 12.04,13.99 13.29,15.24 U$64.B- | v8.91,71.11 16.29,78.49 U$62.LOAD-
N$45  (via drill 0.35)
  Top 0.152: 10.91,27.24 7.04,23.36 7.04,18.99 8.16,17.86 U$64.SDA | 10.91,27.24 13.91,30.24 13.91,31.74 U$66.SDA | 10.91,27.24 v7.66,30.49
  Bottom 0.152: v7.66,30.49 4.54,30.49 4.54,35.49 9.41,40.37 18.16,40.37 22.79,44.99 U$61.SDA
N$46  (via drill 0.35)
  Top 0.152: U$64.SCL 8.29,20.36 16.41,28.49 16.41,31.74 U$66.SCL 16.54,31.86 18.16,33.49 v18.16,33.74 | v20.41,35.99 20.41,39.24 22.79,41.62 22.79,42.49 U$61.SCL
  Bottom 0.152: v18.16,33.74 v20.41,35.99
N$47
  Bottom 0.152: U$62.BAT+ 16.41,86.11 18.04,84.49 18.04,60.99 16.79,60.99 13.41,57.62 J1.2
N$48
  Top 0.152: U$66.VIN 8.91,31.74 9.16,31.74 10.66,30.24 12.16,30.24 13.04,31.11 13.04,33.12 14.16,34.24 17.79,34.24 17.91,34.37 18.41,34.37 18.79,33.99 18.79,20.74 15.91,17.86 U$64.VCC 15.79,17.74 15.79,15.99 9.41,9.62 2.54,9.62 U$61.3V
N$49
  Bottom 0.152: U$62.BAT- 16.29,88.74 8.29,80.74 8.29,55.62 13.41,55.62 J1.1
N$50
  Top 0.152: J2.5 4.91,85.74 5.54,85.74 8.91,89.11 8.91,95.99 11.54,98.61 17.79,98.61 20.16,96.24 U$62.USB-
N$51
  Top 0.152: J2.1 4.91,88.36 5.54,88.36 8.54,91.36 8.54,96.11 11.41,98.99 19.91,98.99 22.66,96.24 U$62.USB+
N$52
  Top 0.152: U$65.CH1 11.41,36.24 11.16,36.24 8.66,38.74 2.04,38.74 1.29,39.49 1.29,41.24 2.54,42.49 U$61.1/TX
N$53
  Top 0.152: U$65.CH0 13.91,36.24 13.66,36.24 9.91,39.99 2.54,39.99 U$61.0/RX
N$54  (via drill 0.35)
  Top 0.152: v10.16,36.24 8.91,36.24 U$65.B_CH_A
  Bottom 0.152: v10.16,36.24 11.29,37.37 22.79,37.37 U$61.6
N$57  (via drill 0.35)
  Top 0.152: v11.41,33.99 11.41,31.86 U$66.RST
  Bottom 0.152: v11.41,33.99 9.54,35.87 9.54,39.99 22.79,39.99 U$61.5